# EAGLE schematic evaluation (EAGLE 7.2.0)
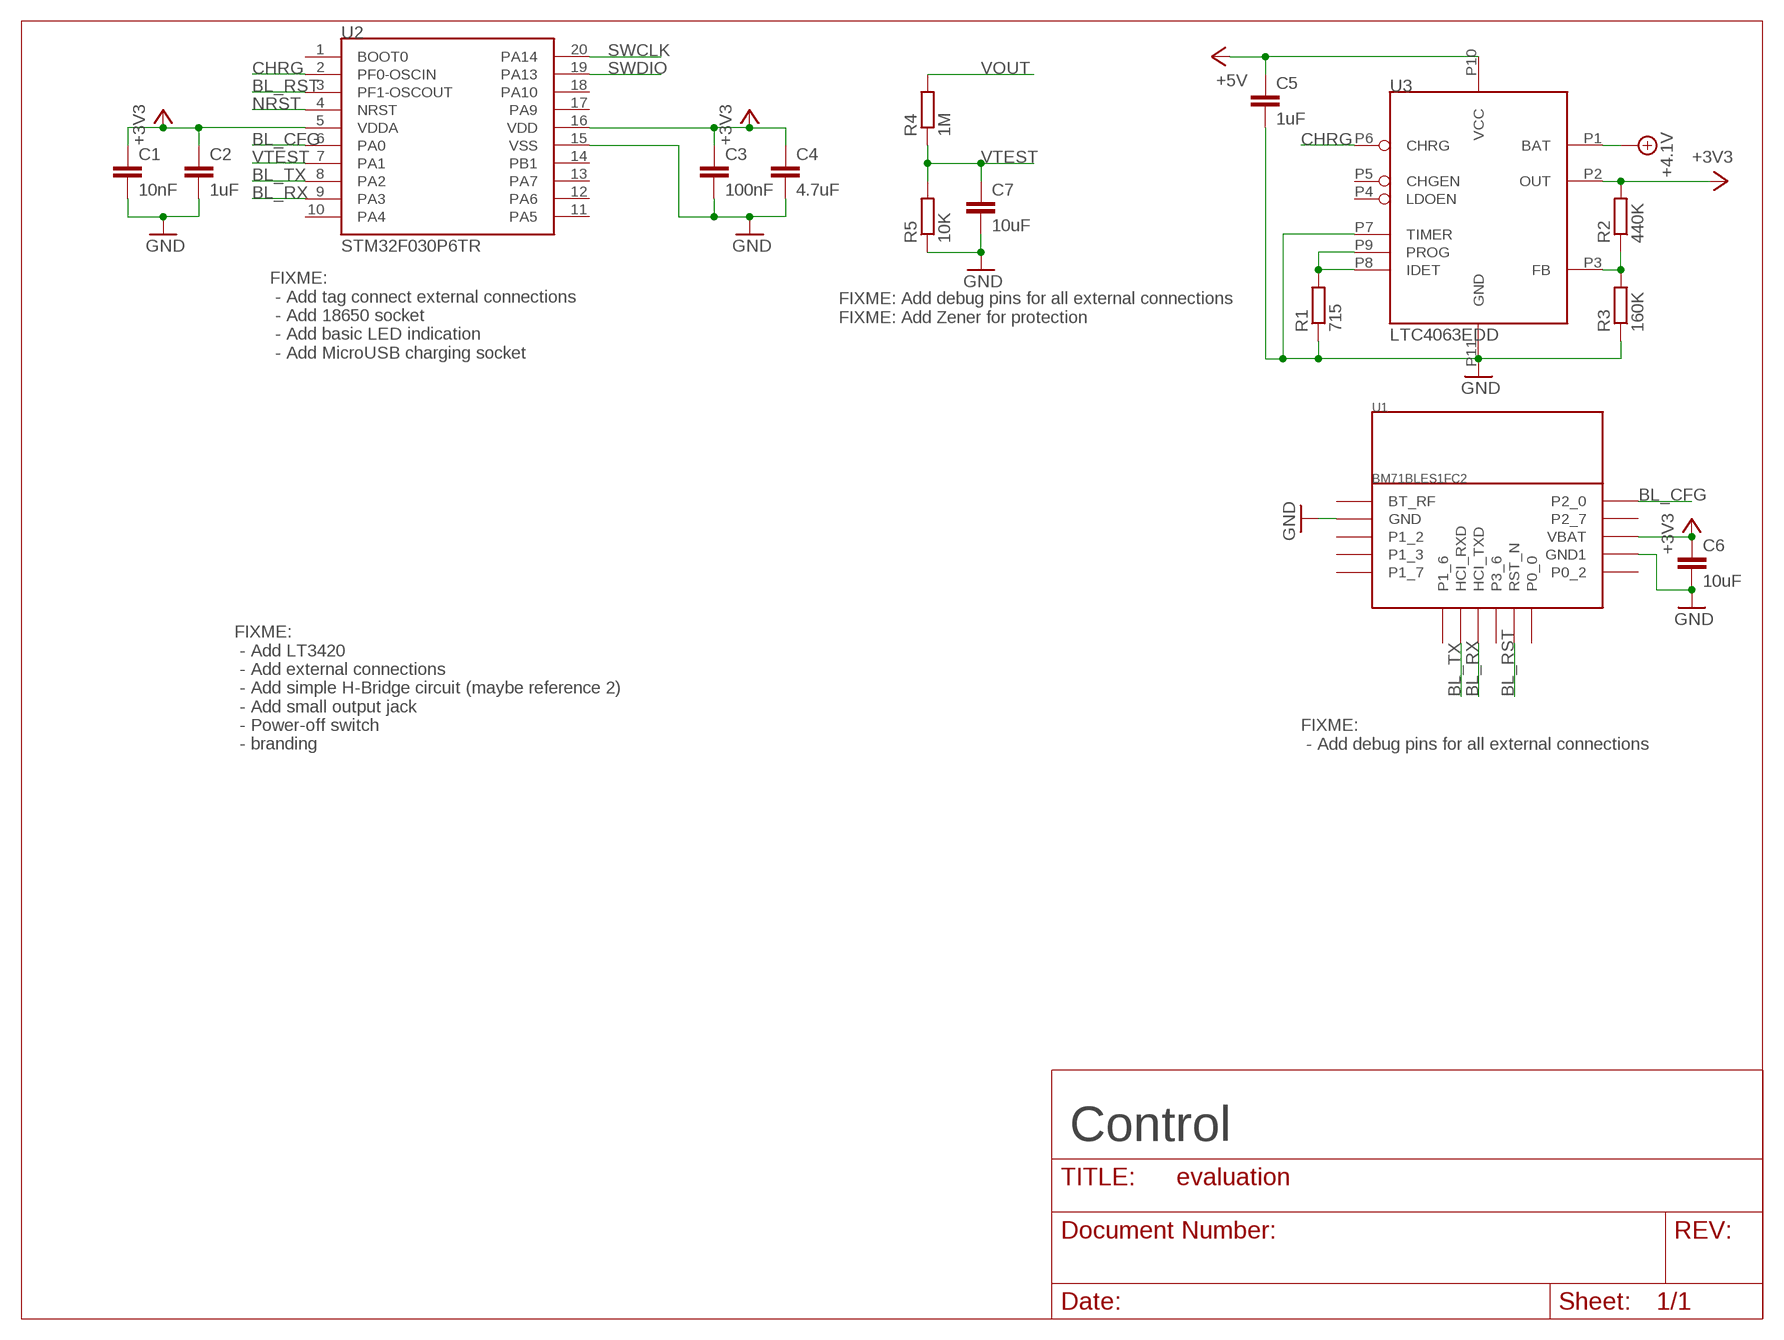
[diagram p0: schematic, sheet 1]

## Parts
C1  10nF  C-0402  [C0402]
C2  1uF  C-0402  [C0402]
C3  100nF  C-0402  [C0402]
C4  4.7uF  C-0402  [C0402]
C5  1uF  C-0402  [C0402]
C6  10uF  C-0402  [C0402]
C7  10uF  C-0402  [C0402]
R1  715  R-0402  [R0402]
R2  440K  R-0402  [R0402]
R3  160K  R-0402  [R0402]
R4  1M  R-0805  [R0805]
R5  10K  R-0805  [R0805]
U1  BM71BLES1FC2  [BM71BLES1FC2]
U2  STM32F030P6TR  [TSSOP20]
U3  LTC4063EDD  [LTC4063]

## Nets
+3V3: C1.1 C2.1 C3.1 C4.1 C6.1 R2.2 U1.P$14(VBAT) U2.5(VDDA) U2.16(VDD) U3.P2(OUT)
+4.1V: U3.P1(BAT)
+5V: C5.1 U3.P10(VCC)
BL_CFG: U1.P$16(P2_0) U2.6(PA0)
BL_RST: U1.P$10(RST_N) U2.3(PF1-OSCOUT)
BL_RX: U1.P$8(HCI_TXD) U2.9(PA3)
BL_TX: U1.P$7(HCI_RXD) U2.8(PA2)
CHRG: U2.2(PF0-OSCIN) U3.P6(CHRG)
GND: C1.2 C2.2 C3.2 C4.2 C5.2 C6.2 C7.2 R1.1 R3.1 R5.1 U1.P$2(GND) U1.P$13(GND1) U2.15(VSS) U3.P7(TIMER) U3.P11(GND)
N$2: R2.1 R3.2 U3.P3(FB)
N$3: R1.2 U3.P8(IDET) U3.P9(PROG)
NRST: U2.4(NRST)
SWCLK: U2.20(PA14)
SWDIO: U2.19(PA13)
VOUT: R4.2
VTEST: C7.1 R4.1 R5.2 U2.7(PA1)
Unconnected: U1.P$1(BT_RF) U1.P$3(P1_2) U1.P$4(P1_3) U1.P$5(P1_7) U1.P$6(P1_6) U1.P$9(P3_6) U1.P$11(P0_0) U1.P$12(P0_2) U1.P$15(P2_7) U2.1(BOOT0) U2.10(PA4) U2.11(PA5) U2.12(PA6) U2.13(PA7) U2.14(PB1) U2.17(PA9) U2.18(PA10) U3.P4(LDOEN) U3.P5(CHGEN)

## Notes on the sheet
- FIXME: Add debug pins for all external connections
  FIXME: Add Zener for protection
- FIXME: 
   - Add tag connect external connections
   - Add 18650 socket
   - Add basic LED indication
   - Add MicroUSB charging socket
- FIXME: 
   - Add LT3420
   - Add external connections
   - Add simple H-Bridge circuit (maybe reference 2)
   - Add small output jack
   - Power-off switch
   - branding
- FIXME: 
   - Add debug pins for all external connections
- Control

## Library data of the parts
C1-C7 = lea_components:C-0402
R1-R3 = lea_components:R-0402
R4 R5 = lea_components:R-0805
U1 = lea_components:BM71BLE
U2 = lea_components:STM32F030: STM32F030F4P6; DIGIKEY#: 497-14044-5-ND
U3 = lea_components:LTC4063: LTC4063 - Standalone Linear Li-Ion Charger with Micropower Low Dropout Linear Regulator; DIGIKEY#: LTC4063EDD#PBF-ND